# EAGLE design tremolo (EAGLE 7.5.0)
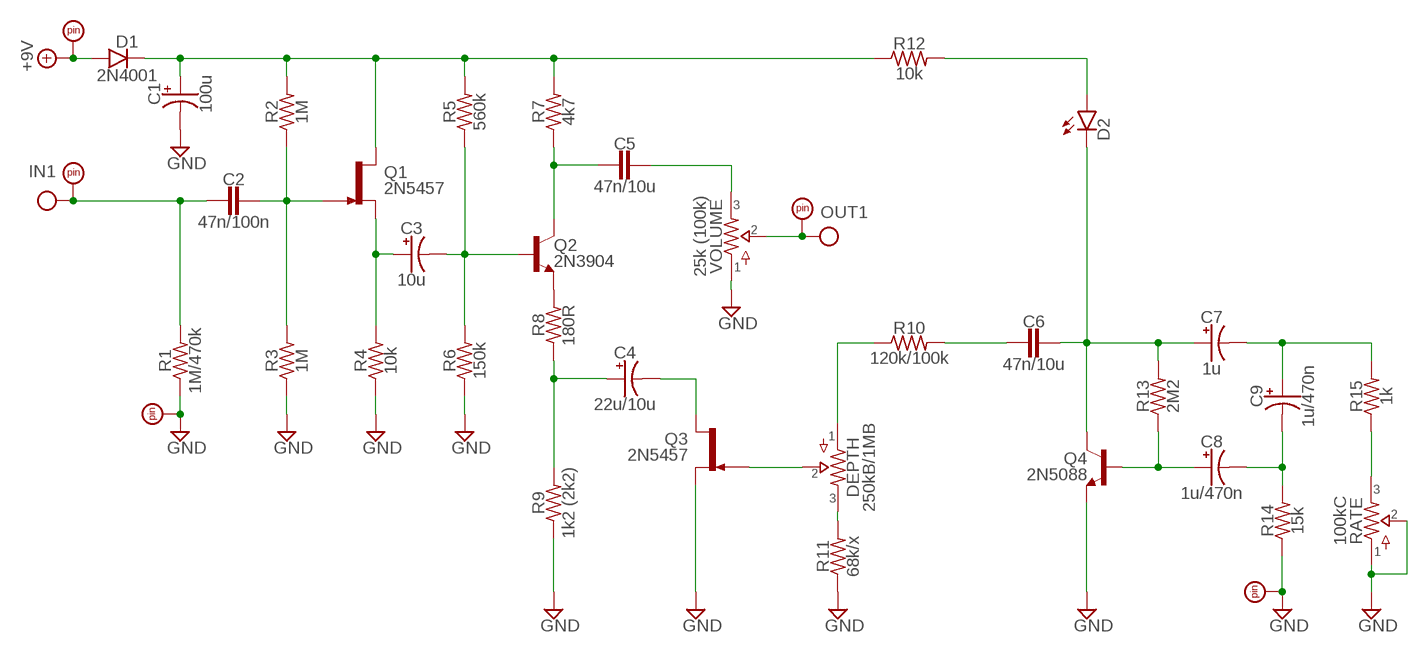
[diagram p0: schematic, sheet 1]

## Parts
C1  100u  0501  [050_020_1]
C2  47n/100n  CER/FILMBOX.1  [BOX_SMALL]
C3  10u  0501  [050_020_1]
C4  22u/10u  0501  [050_020_1]
C5  47n/10u  CER/FILMBOX.1  [BOX_SMALL]
C6  47n/10u  CER/FILMBOX.1  [BOX_SMALL]
C7  1u  0501  [050_020_1]
C8  1u/470n  0501  [050_020_1]
C9  1u/470n  0501  [050_020_1]
D1  2N4001  DO41.2  [DO41-2]
D2  LEDA  [3MM_A]
DEPTH  250kB/1MB  POTSSMALL_PADS  [PADS_SMALL]
PAD1  PADSQR  [SQUARE]
PAD2  PADSQR  [SQUARE]
PAD3  PADSQR  [SQUARE]
PAD4  PADRND  [ROUND]
PAD5  PADRND  [ROUND]
Q1  2N5457  [TO92-]
Q2  2N3904  [TO92-]
Q3  2N5457  [TO92-]
Q4  2N5088  [TO92-]
R1  1M/470k  R_.3B  [R0207/3]
R2  1M  R_.3B  [R0207/3]
R3  1M  R_.3B  [R0207/3]
R4  10k  R_.3B  [R0207/3]
R5  560k  R_.3B  [R0207/3]
R6  150k  R_.3B  [R0207/3]
R7  4k7  R_.3B  [R0207/3]
R8  180R  R_.3B  [R0207/3]
R9  1k2 (2k2)  R_.3B  [R0207/3]
R10  120k/100k  R_.3B  [R0207/3]
R11  68k/x  R_.3B  [R0207/3]
R12  10k  R_.3B  [R0207/3]
R13  2M2  R_.3B  [R0207/3]
R14  15k  R_.3B  [R0207/3]
R15  1k  R_.3B  [R0207/3]
RATE  100kC  POTSSMALL_PADS  [PADS_SMALL]
VOLUME  25k (100k)  POTSTRIM  [2262_TRIM]

## Nets
+9V: D1.A PAD1.1
GND: C1.- PAD4.1 PAD5.1 Q3.2(S) Q4.3(E) R1.1 R3.1 R4.1 R6.1 R9.1 R11.1 R14.1 RATE.1 RATE.2 VOLUME.1
IN: C2.2 PAD2.1 R1.2
N$1: C2.1 Q1.1(G) R2.1 R3.2
N$2: C3.+ Q1.2(S) R4.2
N$3: C3.- Q2.2(B) R5.1 R6.2
N$4: C5.2 Q2.1(C) R7.1
N$5: Q2.3(E) R8.2
N$6: C5.1 VOLUME.3
N$7: C1.+ D1.C Q1.3(D) R2.2 R5.2 R7.2 R12.1
N$8: C4.+ R8.1 R9.2
N$9: C4.- Q3.3(D)
N$10: DEPTH.2 Q3.1(G)
N$11: DEPTH.1 R10.1
N$12: C6.2 R10.2
N$13: C6.1 C7.+ D2.K(C) Q4.1(C) R13.2
N$14: C8.+ Q4.2(B) R13.1
N$15: C7.- C9.+ R15.2
N$16: C8.- C9.- R14.2
N$17: DEPTH.3 R11.2
N$18: R15.1 RATE.3
N$19: D2.A R12.2
OUT: PAD3.1 VOLUME.2

## Library data of the parts
C1 C3 C4 C7-C9 = capacitors-elec:050: 0.22 - 100uF Xicon values at Mouser.com: 10V: 10 - 100uF; 16V: 2.2 - 47uF; 25V: 0.47 - 47uF; 50V: 0.22 - 22uF
C2 C5 C6 = capacitors-film:CER/FILM: 47 - 120pF Xicon Ceramic Disc 2.5mm lead spacing
D1 = diodes:DO41: DO-41 Package Diodes: 1N4001 - 1N40019 Zener Diodes: 1N4728 - 1N4764
D2 = diodes:LED
DEPTH RATE VOLUME = potentiometers:POTS
PAD1-PAD5 = supply pins:PAD
Q1 Q3 = transistors:2N5457: N-CHANNEL JFET
Q2 = transistors:2N3904: NPN Transistor
Q4 = transistors:2N5088: NPN Transistor
R1-R15 = resistors:R_

## Board
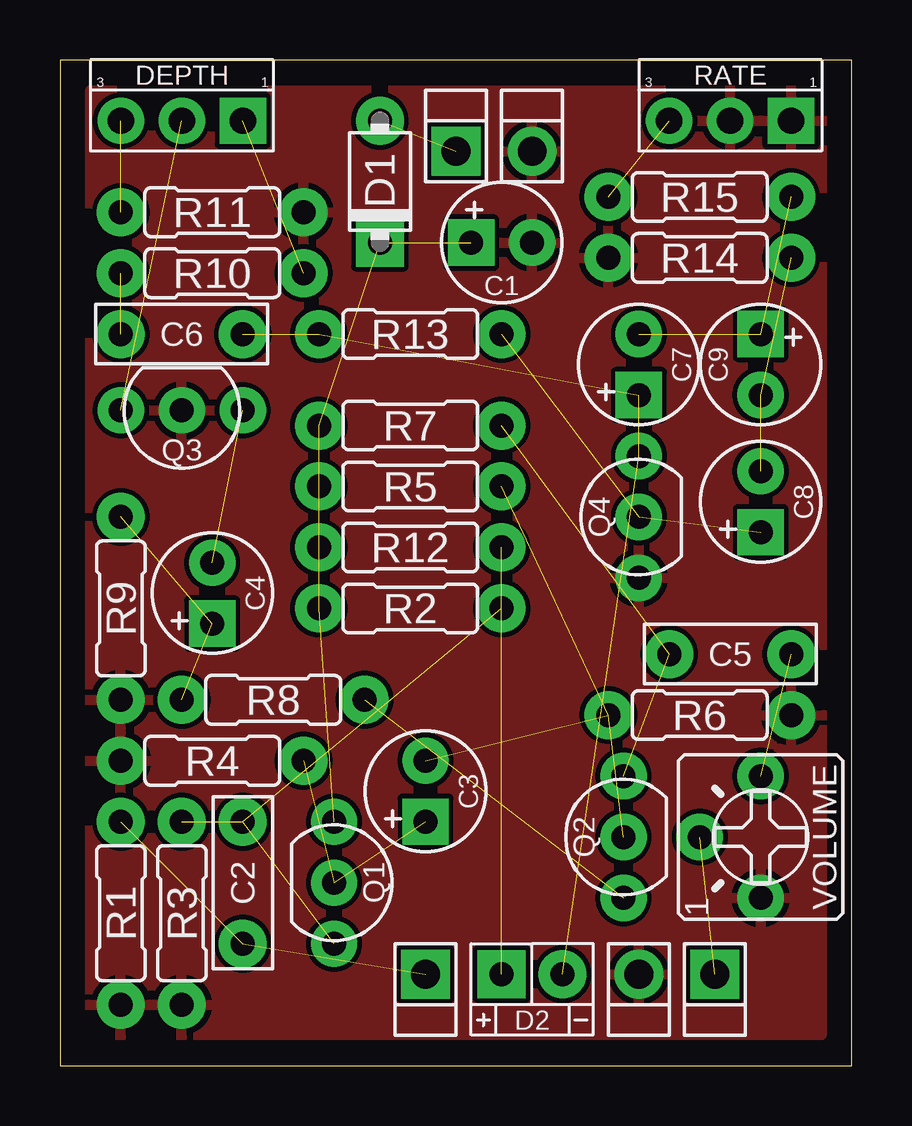
[diagram p1: board, top side]
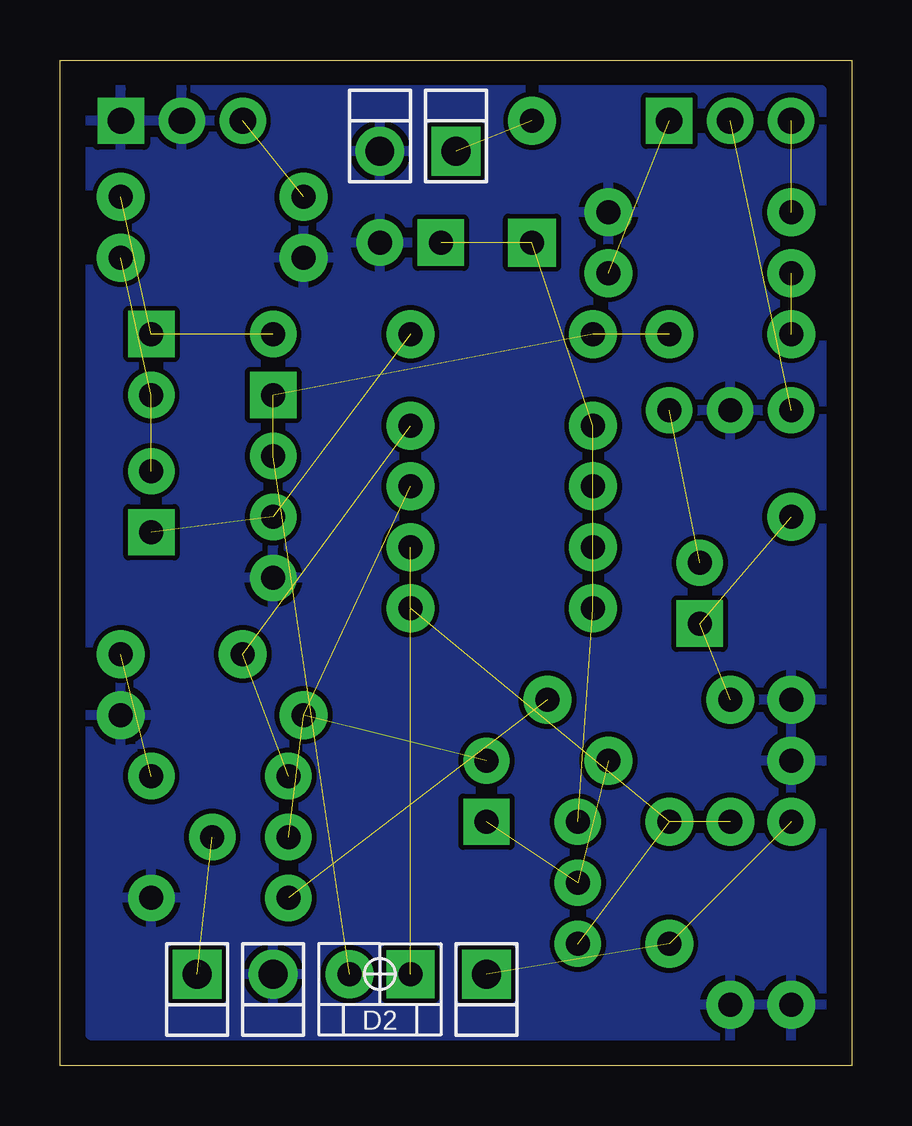
[diagram p2: board, bottom side, seen from below]

Size 33.02 x 41.9 mm. Coordinates in mm from the lower left corner, seen from the top.
Outline: 0,0 33.02,0 33.02,41.9 0,41.9 0,0
Copper layers (1*16): Top 0.035mm / dielectric 1.5mm / Bottom 0.035mm
Design rules "default": minimum track width 10mil, minimum drill 24mil, track to track 8mil, track to pad 8mil, pad to pad 8mil, via to via 8mil, smd to smd 8mil, copper to edge 40mil, drill to drill 8mil, minimum pad ring 10mil, minimum via ring 8mil, stop-mask expansion 4mil, vias tented up to drill 0mil, thermal gap 10mil

### Footprints (pad centres in the part's own frame; a part is rotated, then mirrored left to right if it is on the bottom)
050_020_1 = drill 1 pad 1.93 square: + -1.27,0 | drill 1 pad 1.93: - 1.27,0
BOX_SMALL = drill 1 pad 2: 1 -2.54,0; 2 2.54,0
DO41-2 = drill 1 pad 2: A 2.54,0 | drill 1 pad 2 square: C -2.54,0
3MM_A = drill 1 pad 2 square: A -1.27,0 | drill 1 pad 2: K 1.27,0
PADS_SMALL = drill 1.1 pad 1.93 square: 1 2.54,0 | drill 1.1 pad 1.93: 2 0,0; 3 -2.54,0
SQUARE = drill 1.2 pad 2.032 square: 1 0,0
ROUND = drill 1.2 pad 2.032: 1 0,0
TO92- = drill 1 pad 1.93: 1 2.54,0; 2 0,0; 3 -2.54,0
R0207/3 = drill 1 pad 2: 1 -3.81,0; 2 3.81,0
2262_TRIM = drill 1 pad 1.93: 1 -2.54,0; 2 0,2.54; 3 2.54,0

### Placement (x,y rotation side)
C1  18.41,34.29 0 top
C2  7.62,7.62 270 top
C3  15.24,11.43 90 top
C4  6.35,19.68 90 top
C5  27.94,17.14 180 top
C6  5.08,30.48 180 top
C7  24.13,29.21 90 top
C8  29.21,23.5 90 top
C9  29.21,29.21 270 top
D1  13.34,36.83 90 top
D2  19.68,3.81 0 top
DEPTH  5.08,39.37 0 top
PAD1  16.51,38.1 180 top
PAD2  15.24,3.81 0 top
PAD3  27.3,3.81 0 top
PAD4  19.68,38.1 180 top
PAD5  24.13,3.81 0 top
Q1  11.43,7.62 270 top
Q2  23.5,9.53 90 top
Q3  5.08,27.3 180 top
Q4  24.13,22.86 90 top
R1  2.54,6.35 90 top
R2  14.61,19.05 180 top
R3  5.08,6.35 90 top
R4  6.35,12.7 0 top
R5  14.61,24.13 180 top
R6  26.67,14.61 180 top
R7  14.61,26.67 180 top
R8  8.89,15.24 0 top
R9  2.54,19.05 90 top
R10  6.35,33.02 180 top
R11  6.35,35.56 180 top
R12  14.61,21.59 0 top
R13  14.61,30.48 180 top
R14  26.67,33.66 0 top
R15  26.67,36.2 0 top
RATE  27.94,39.37 0 top
VOLUME  29.21,9.53 90 top

### Tracks (layer width: path | path; a pad name or v marks a point on that pad's centre or on a via)
+9V  (1 unrouted)
GND
  pour Bottom: 1.27,40.64 31.75,40.64 31.75,1.27 1.27,1.27
  pour Top: 1.27,40.64 31.75,40.64 31.75,1.27 1.27,1.27
IN  (2 unrouted)
N$1  (3 unrouted)
N$2  (2 unrouted)
N$3  (3 unrouted)
N$4  (2 unrouted)
N$5  (1 unrouted)
N$6  (1 unrouted)
N$7  (6 unrouted)
N$8  (2 unrouted)
N$9  (1 unrouted)
N$10  (1 unrouted)
N$11  (1 unrouted)
N$12  (1 unrouted)
N$13  (4 unrouted)
N$14  (2 unrouted)
N$15  (2 unrouted)
N$16  (2 unrouted)
N$17  (1 unrouted)
N$18  (1 unrouted)
N$19  (1 unrouted)
OUT  (1 unrouted)